# Altium schematic sheet tb6612fng.SchDoc
size A4
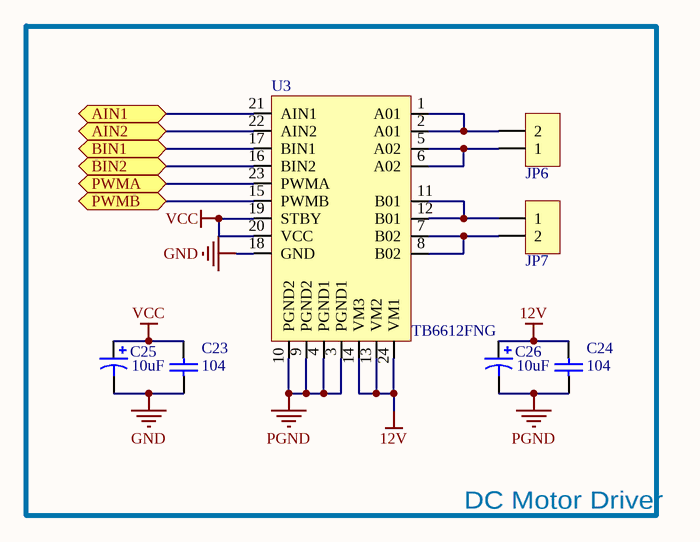
[diagram p0: tb6612fng.SchDoc]

## Parts
C23  104  [C 0603_L]
C24  104  [C 0603_L]
C25  10uF  [CD A(3216)]
C26  10uF  [CD A(3216)]
JP6  HDR-1X2  [XH2.54-LI-2P]  (value not drawn)
JP7  HDR-1X2  [XH2.54-LI-2P]  (value not drawn)
U3  TB6612FNG  [SSOP24_N]

## Blocks framed on the sheet
DC Motor Driver: C23-C26 JP6 JP7 U3

## Ports
AIN1 (bidir), AIN2 (bidir), BIN1 (bidir), BIN2 (bidir), PWMA (bidir), PWMB (bidir)

## Nets
12V: C24.2 C26.1 U3.13(VM2) U3.14(VM3) U3.24(VM1)
GND: C23.1 C25.2 U3.18(GND)
PGND: C24.1 C26.2 U3.3(PGND1) U3.4(PGND1) U3.9(PGND2) U3.10(PGND2)
VCC: C23.2 C25.1 U3.19(STBY) U3.20(VCC)
AIN1: U3.21(AIN1) ; port AIN1
AIN2: U3.22(AIN2) ; port AIN2
BIN1: U3.17(BIN1) ; port BIN1
BIN2: U3.16(BIN2) ; port BIN2
PWMA: U3.23(PWMA) ; port PWMA
PWMB: U3.15(PWMB) ; port PWMB
NetJP6_1: JP6.1 U3.5(A02) U3.6(A02)
NetJP6_2: JP6.2 U3.1(A01) U3.2(A01)
NetJP7_1: JP7.1 U3.11(B01) U3.12(B01)
NetJP7_2: JP7.2 U3.7(B02) U3.8(B02)

## Library data of the parts
C23 C24 = Cap: Capacitor; Published: 8-Jun-2000; LatestRevisionDate: 17-Jul-2002; LatestRevisionNote: Re-released for DXP Platform.; PackageReference: RAD-0.3; Publisher: Altium Limited; PackageDescription: Radial Cap, Thru-Hole; 2 Leads; 0.3 in Pin Spacing; Value: 104
C25 C26 = Cap Pol1: Polarized Capacitor (Radial); Published: 8-Jun-2000; LatestRevisionDate: 17-Jul-2002; LatestRevisionNote: Re-released for DXP Platform.; PackageReference: RB7.6-15; Publisher: Altium Limited; PackageDescription: Polarized Capacitor (Radial); 2 Leads; Value: 10uF
JP6 JP7 = Header 2: 2P接插件; 版权归属: 源创客; BOM名称: 2P接插件; 学习资源: www.ooocke.com
U3 = TB6612FNG: DC_MOTOR_DRIVER